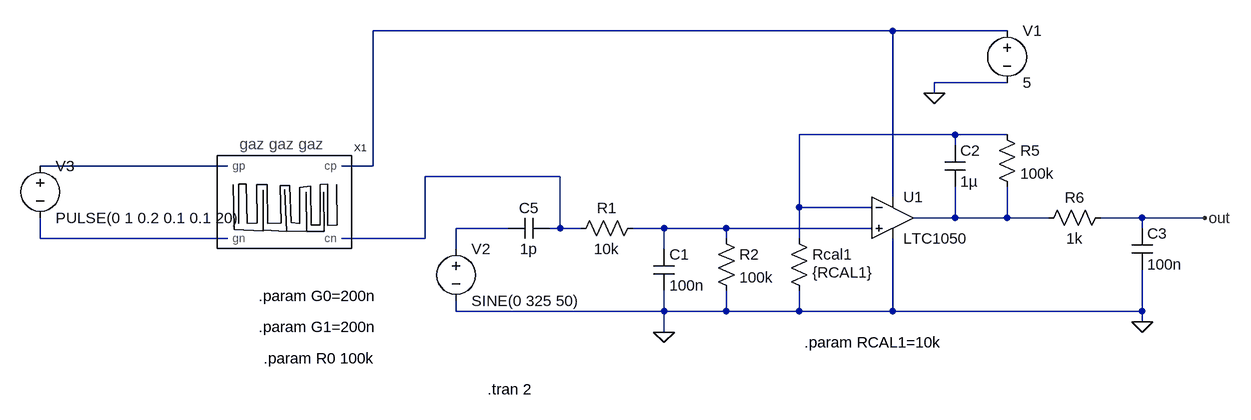
[diagram p0: schematic Draft2.asc]
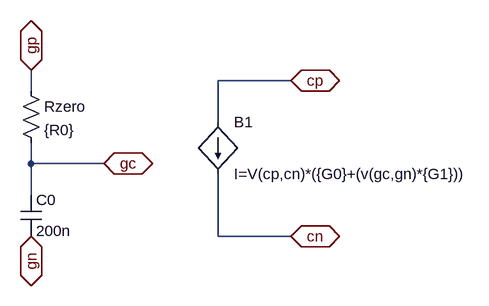
[diagram p1: sub-circuit gazgazgaz.asc]
Draft2.asc, the LTspice schematic file:
Version 4
SHEET 1 880 680
WIRE 256 -144 -544 -144
WIRE 432 -144 256 -144
WIRE 432 -64 320 -64
WIRE 320 -48 320 -64
WIRE 352 16 112 16
WIRE 432 16 352 16
WIRE 352 32 352 16
WIRE -768 64 -1056 64
WIRE -544 64 -544 -144
WIRE -544 64 -592 64
WIRE -256 80 -464 80
WIRE 256 112 256 -144
WIRE 112 128 112 16
WIRE 224 128 112 128
WIRE 352 144 352 96
WIRE 352 144 288 144
WIRE 432 144 432 96
WIRE 432 144 352 144
WIRE 496 144 432 144
WIRE 640 144 576 144
WIRE 736 144 640 144
WIRE -336 160 -416 160
WIRE -256 160 -256 80
WIRE -256 160 -272 160
WIRE -224 160 -256 160
WIRE -96 160 -144 160
WIRE 0 160 -96 160
WIRE 224 160 0 160
WIRE 640 160 640 144
WIRE -1056 176 -1056 144
WIRE -768 176 -1056 176
WIRE -464 176 -464 80
WIRE -464 176 -592 176
WIRE 0 176 0 160
WIRE 112 176 112 128
WIRE -416 192 -416 160
WIRE -96 192 -96 160
WIRE -416 288 -416 272
WIRE -96 288 -96 256
WIRE -96 288 -416 288
WIRE 0 288 0 256
WIRE 0 288 -96 288
WIRE 112 288 112 256
WIRE 112 288 0 288
WIRE 256 288 256 176
WIRE 256 288 112 288
WIRE 640 288 640 224
WIRE 640 288 256 288
WIRE 640 304 640 288
WIRE -96 320 -96 288
FLAG -96 320 0
FLAG 640 304 0
FLAG 320 -48 0
FLAG 736 144 out
SYMBOL res -128 144 R90
WINDOW 0 0 56 VBottom 2
WINDOW 3 32 56 VTop 2
SYMATTR InstName R1
SYMATTR Value 10k
SYMBOL cap -112 192 R0
SYMATTR InstName C1
SYMATTR Value 100n
SYMBOL res -16 160 R0
SYMATTR InstName R2
SYMATTR Value 100k
SYMBOL res 96 160 R0
WINDOW 3 36 68 Left 2
SYMATTR InstName Rcal1
SYMATTR Value {RCAL1}
SYMBOL cap 336 32 R0
SYMATTR InstName C2
SYMATTR Value 1µ
SYMBOL res 416 0 R0
SYMATTR InstName R5
SYMATTR Value 100k
SYMBOL res 592 128 R90
WINDOW 0 0 56 VBottom 2
WINDOW 3 32 56 VTop 2
SYMATTR InstName R6
SYMATTR Value 1k
SYMBOL cap 624 160 R0
SYMATTR InstName C3
SYMATTR Value 100n
SYMBOL voltage 432 -160 R0
WINDOW 123 0 0 Left 0
WINDOW 39 0 0 Left 0
SYMATTR InstName V1
SYMATTR Value 5
SYMBOL OpAmps\\LTC1050 256 80 R0
SYMATTR InstName U1
SYMBOL voltage -416 176 R0
WINDOW 123 0 0 Left 0
WINDOW 39 0 0 Left 0
SYMATTR InstName V2
SYMATTR Value SINE(0 325 50)
SYMBOL cap -272 144 R90
WINDOW 0 0 32 VBottom 2
WINDOW 3 32 32 VTop 2
SYMATTR InstName C5
SYMATTR Value 1p
SYMBOL voltage -1056 48 R0
WINDOW 123 0 0 Left 0
WINDOW 39 0 0 Left 0
SYMATTR InstName V3
SYMATTR Value PULSE(0 1 0.2 0.1 0.1 20)
SYMBOL gazgazgaz -672 112 R0
SYMATTR InstName X1
TEXT -368 408 Left 2 !.tran 2
TEXT -720 264 Left 2 !.param G0=200n
TEXT -720 312 Left 2 !.param G1=200n
TEXT -712 360 Left 2 !.param R0 100k
TEXT 120 336 Left 2 !.param RCAL1=10k

gazgazgaz.asc, the sub-circuit schematic file:
Version 4
SHEET 1 880 680
WIRE 352 48 240 48
WIRE -48 64 -48 32
WIRE 240 112 240 48
WIRE -48 176 -48 144
WIRE 64 176 -48 176
WIRE -48 224 -48 176
WIRE 240 288 240 192
WIRE 352 288 240 288
FLAG 352 48 cp
IOPIN 352 48 BiDir
FLAG 352 288 cn
IOPIN 352 288 BiDir
FLAG -48 32 gp
IOPIN -48 32 BiDir
FLAG -48 288 gn
IOPIN -48 288 BiDir
FLAG 64 176 gc
IOPIN 64 176 BiDir
SYMBOL bi 240 112 R0
SYMATTR InstName B1
SYMATTR Value I=V(cp,cn)*({G0}+(v(gc,gn)*{G1}))
SYMBOL res -64 48 R0
SYMATTR InstName Rzero
SYMATTR Value {R0}
SYMBOL cap -64 224 R0
SYMATTR InstName C0
SYMATTR Value 200n

The netlist it stands for:
* Draft2.asc
R1 N007 N004 10k
C1 N007 0 100n
R2 N007 0 100k
Rcal1 N002 0 {RCAL1}
C2 N002 N005 1µ
R5 N002 N005 100k
R6 out N005 1k
C3 out 0 100n
V1 N001 0 5
XU1 N007 N002 N001 0 N005 LTC1050  ; pins In+ In- V+ V- OUT
V2 N006 0 SINE(0 325 50)
C5 N004 N006 1p
V3 N003 N008 PULSE(0 1 0.2 0.1 0.1 20)
XX1 N001 N004 N003 N008 gazgazgaz

* block symbol definitions
.subckt gazgazgaz cp cn gp gn
B1 cp cn I=V(cp,cn)*({G0}+(v(gc,gn)*{G1}))
Rzero gp gc {R0}
C0 gc gn 200n
.ends gazgazgaz

.tran 2
.param G0=200n
.param G1=200n
.param R0 100k
.param RCAL1=10k
.lib LTC.lib
.backanno
.end